# Altium schematic sheet Sheet1.SchDoc
size A
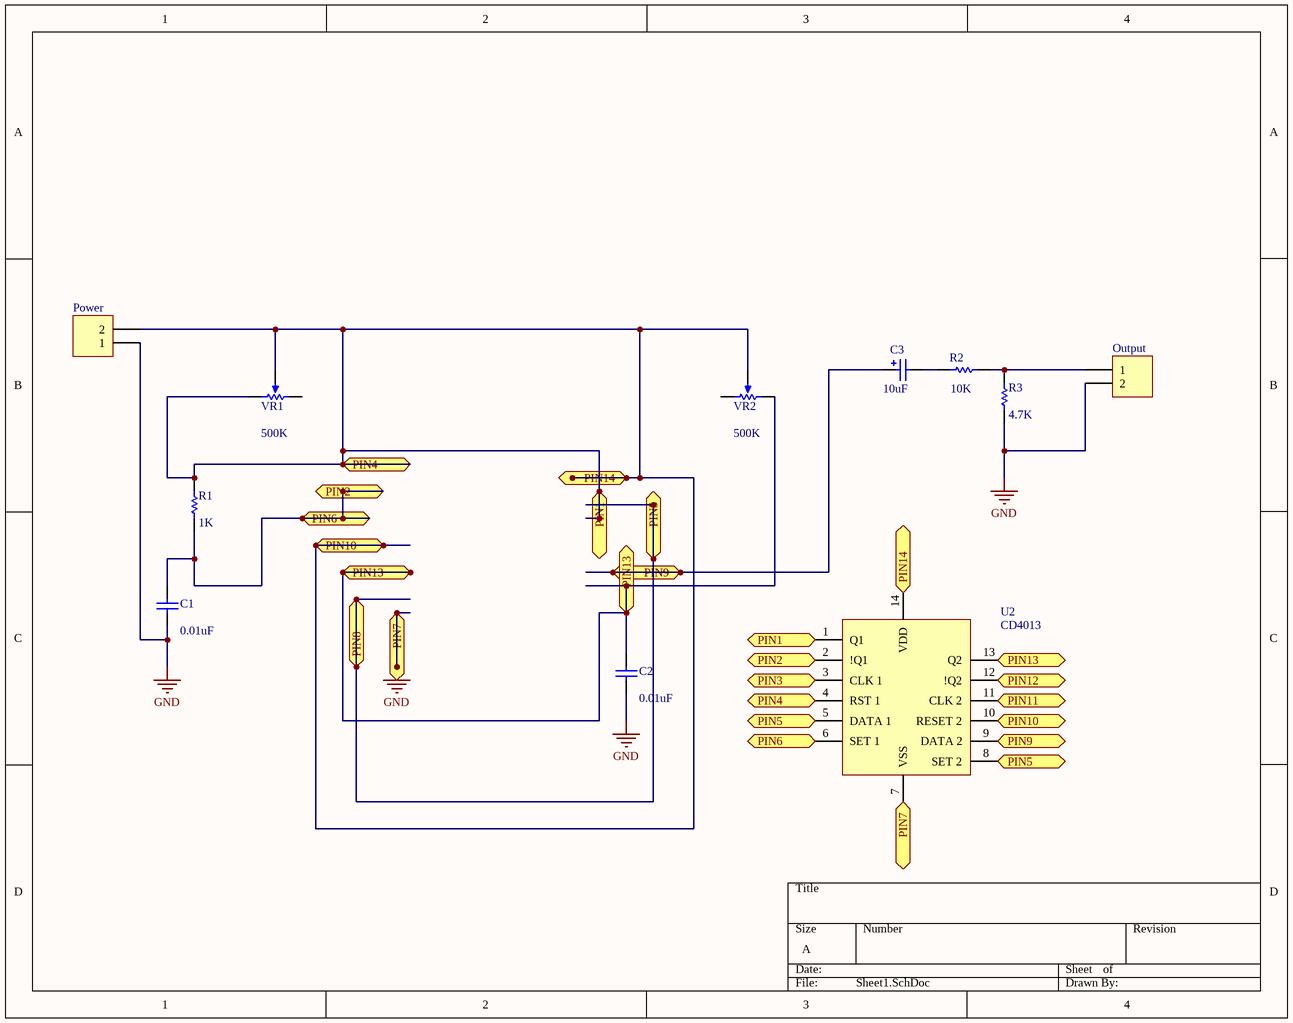
[diagram p0: Sheet1.SchDoc]

## Parts
C1  value 0.01uF  [Cap ceramico 4mm]
C2  value 0.01uF  [Cap ceramico 4mm]
C3  value 10uF  [Capacitor elec 5MM (3PP)]
Output  (no value)  [HDR1X2]
Power  (no value)  [HDR1X2]
R1  value 1K  [AXIAL-0.3]
R2  value 10K  [AXIAL-0.3]
R3  value 4.7K  [AXIAL-0.3]
U2  CD4013  [DIP14]
VR1  value 500K  [Pot metal slanted]
VR2  value 500K  [Pot metal slanted]

## Ports
PIN1, PIN2, PIN3, PIN4, PIN5, PIN6, PIN7, PIN8, PIN9, PIN10, PIN11, PIN12, PIN13, PIN14

## Nets
GND: C1.1 C2.1 Output.2 Power.1 R3.1 U2.7(VSS) ; port PIN7
PIN1: Power.2 R1.2 U2.1(Q1) U2.4(RST_1) U2.10(RESET_2) U2.14(VDD) VR1.2(TAP) VR1.3(BOT) VR2.2(TAP) ; port PIN1, port PIN4, port PIN10, port PIN14
PIN2: C1.2 R1.1 U2.2(!Q1) U2.6(SET_1) ; port PIN2, port PIN6
PIN3: U2.3(CLK_1) ; port PIN3
PIN5: U2.5(DATA_1) U2.8(SET_2) ; port PIN5, port PIN8
PIN9: C3.1 U2.9(DATA_2) ; port PIN9
PIN11: U2.11(CLK_2) ; port PIN11
PIN12: C2.2 U2.12(!Q2) U2.13(Q2) VR2.1(TOP) ; port PIN12, port PIN13
NetC3_2: C3.2 R2.1
NetOutput_1: Output.1 R2.2 R3.2

Not connected (* = marked no-connect by the designer): VR1 1(TOP); VR2 3(BOT)

## Library data of the parts
C1 C2 = Capacitor
C3 = Capacitor Electrolytic
Output Power = Header 2: Header, 2-Pin; LatestRevisionDate: 17-Jul-2002; LatestRevisionNote: Re-released for DXP Platform.; Publisher: Altium Limited
R1-R3 = Res1: Resistor; Published: 8-Jun-2000; LatestRevisionDate: 17-Jul-2002; LatestRevisionNote: Re-released for DXP Platform.; PackageReference: AXIAL-0.3; Publisher: Altium Limited; PackageDescription: Axial Device, Thru-Hole; 2 Leads; 0.3 in Pin Spacing
U2 = CD4013: Dual D Flip-flop
VR1 VR2 = Rotary Potentiometer